# EasyEDA Pro project pcb工程文件.epro, board bat-1
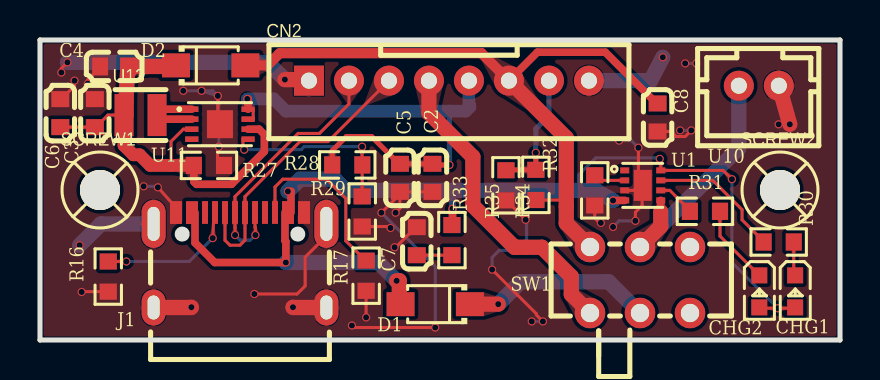
[diagram p4: board, top side]
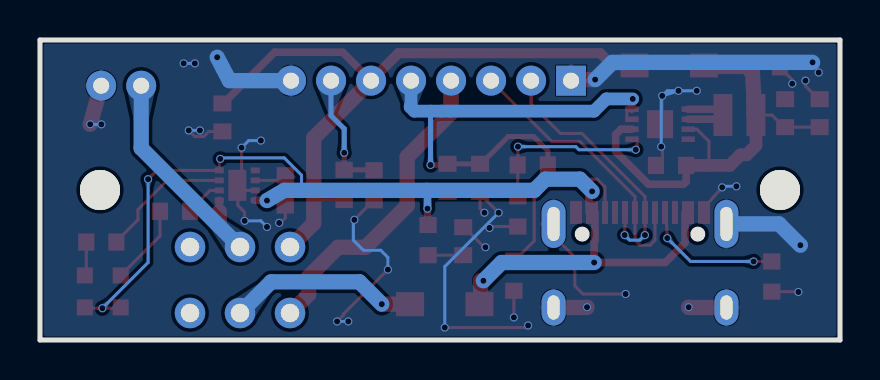
[diagram p5: board, bottom side, seen from below]

Outline 40 x 15 mm; copper layers: Top Layer, Bottom Layer. Coordinates in mm from the lower left corner of the outline.
Outline path: 0,15 40,15 40,0 0,0 0,15
Stack: Top Layer 0.035mm / SUBSTRATE1 1.51mm er 5 / Bottom Layer 0.035mm

## Design rules (mm)
spacing safeClearance (default): track to track 0.152, other pairs 0 to 0.152
track width trackWidth (default): min 0.152, default 0.152, max 0.152
differential pair differentialPair (default): width min 0.127, default 0.254, max 2.54; gap min 0.152, default 0.152
via viaSize (default): diameter min 0.5, default 0.61, max 10; hole min 0.3, default 0.305, max 6
net GND uses POR61265633
pour ie1328 uses POR94191934
pour ie1329 uses POR61265633

## Placement (name value [footprint] x y rotation side)
C2  100nF  [C0603]  19.62 8.11 90 top
C3  100nF  [C0603]  2.74 11.34 270 top
C4  22uF  [C0603]  3.71 13.68 0 top
C5  22uF  [C0603]  18 8.11 90 top
C6  1uF  [C0603]  1.02 11.34 90 top
C7  10uF  [C0603]  18.84 4.94 90 top
C8  100nF  [C0603]  30.88 11.13 90 top
CHG1  KT-0603R  [LED0603-RD]  37.76 2.43 270 top
CHG2  KT-0603R  [LED0603-RD]  35.97 2.43 270 top
CN2  WAFER-PH2.0-8PZZ  [CONN-TH_8P-P2.00_HDGC2001WV-8P]  20.45 12.97 0 top
D1  DSK34  [SOD-123FL_L2.7-W1.8-LS3.8-RD]  19.76 1.79 180 top
D2  DSK34  [SOD-123FL_L2.7-W1.8-LS3.8-RD]  8.53 13.73 0 top
J1  24018-UCAF001-A  [TYPE-C-USB-SMD_CF003]  10 4 0 top
R16  5.1kΩ  [R0603]  3.41 3.17 90 top
R17  5.1kΩ  [R0603]  16.31 3.21 90 top
R27  1MΩ  [R0603]  8.45 8.73 180 top
R28  220kΩ  [R0603]  15.36 8.75 180 top
R29  68kΩ  [R0603]  16.11 6.43 90 top
R30  1kΩ  [R0603]  36.93 4.9 180 top
R31  1kΩ  [R0603]  33.25 6.44 180 top
R32  5.1kΩ  [R0603]  27.74 7.48 270 top
R33  0Ω  [R0603]  20.6 4.99 270 top
R34  300kΩ  [R0603]  24.79 7.75 270 top
R35  100kΩ  [R0603]  23.3 7.73 270 top
SCREW1  -  [M2__]  3 7.5 0 top
SCREW2  -  [M2__]  37 7.5 0 top
SW1  MSK-22D18G3 051  [SW-TH_HX-MSK-22D18G3-051]  30 3 0 top
U1  LGS4056HDA  [DFN-8_L2.0-W2.0-P0.50-TL-EP1.6]  30.14 7.73 0 top
U10  WAFER-PH2.0-2PZZ  [CONN-TH_2P-P2.00_HC-PH-2A-M]  35.94 12.71 180 top
U11  SY7088DGC  [DFN-8_L3.0-W2.0-P0.50-BL-EP]  9 10.79 270 top
U13  1.5uH  [IND-SMD_L2.5-W2.0_FTC252010S]  5.03 11.25 0 top

## Footprints (pads in the part's own frame, mm; a bottom-side part is the same pattern mirrored in y, then rotated)
C0603
  rect 0.8x0.9 smd: 1(-0.7,0) 2(0.7,0)
CONN-TH_2P-P2.00_HC-PH-2A-M
  round 1.5 hole 0.8: 1(-1,0) 2(1,0)
CONN-TH_8P-P2.00_HDGC2001WV-8P
  rect 1.5x1.5 hole 0.8: 1(-7,0)
  round 1.5 hole 0.8: 2(-5,0) 3(-3,0) 4(-1,0) 5(1,0) 6(3,0) 7(5,0) 8(7,0)
DFN-8_L2.0-W2.0-P0.50-TL-EP1.6
  rect 0.45x0.3 smd: 1(-0.9,0.75) 2(-0.9,0.25) 3(-0.9,-0.25) 4(-0.9,-0.75) 5(0.9,-0.75) 6(0.9,-0.25) 7(0.9,0.25) 8(0.9,0.75)
  rect 0.9x1.55 smd: 9(-0.001,0.002)
DFN-8_L3.0-W2.0-P0.50-BL-EP
  rect 0.28x0.665 smd: 1(-0.75,-1.407) 2(-0.25,-1.407) 3(0.25,-1.407) 4(0.75,-1.407) 5(0.75,1.407) 6(0.25,1.407) 7(-0.25,1.407) 8(-0.75,1.407)
  rect 1.4x1.3 smd: 9(0,0)
IND-SMD_L2.5-W2.0_FTC252010S
  rect 0.95x2.1 smd: 1(-0.825,0) 2(0.825,0)
LED0603-RD
  rect 0.8x0.8 smd: 1(-0.799,0) 2(0.799,0)
M2__
  round 2 hole 2: 1(0,0)
R0603
  rect 0.806x0.864 smd: 1(-0.753,0) 2(0.753,0)
SOD-123FL_L2.7-W1.8-LS3.8-RD
  rect 1.4x1.2 smd: 1(-1.735,0) 2(1.735,0)
SW-TH_HX-MSK-22D18G3-051
  round 1.524 hole 0.914: 1(-2.5,1.65) 2(0,1.65) 3(2.5,1.65) 4(-2.5,-1.65) 5(0,-1.65) 6(2.5,-1.65)
TYPE-C-USB-SMD_CF003
  oval 1.2x2.4 hole 0.6x1.7: 17(4.32,1.805) 20(-4.32,1.805)
  oval 1.2x1.8 hole 0.6x1.2: 18(4.32,-2.375) 19(-4.32,-2.375)
  rect 0.3x1.14 smd: A1(-3.35,2.373) A4(-2.55,2.371) A5(-1.25,2.375) A6(-0.25,2.375) A7(0.25,2.373) A8(1.25,2.375) A9(2.55,2.375) A12(3.35,2.375) B1(3.05,2.375) B4(2.25,2.375) B5(1.75,2.375) B6(0.75,2.375) B7(-0.75,2.373) B8(-1.75,2.375) B9(-2.25,2.371) B12(-3.05,2.373)

## Nets
5VIN: CN2.4 SW1.4
GND: C2.1 C3.1 C4.1 C5.1 C6.2 C7.2 C8.1 CN2.1 CN2.8 J1.17 J1.18 J1.19 J1.20 J1.A1 J1.A12 J1.B1 J1.B12 R16.1 R17.1 R27.1 R29.1 R32.2 R35.2 U1.3 U1.9 U10.1 U11.9
VBAT: C8.2 CN2.6 D2.2 R34.2 SW1.1
VCC_SERVO: C2.2 C5.2 CN2.5 R28.2 U11.7 U11.8
$$$1: R28.1 R29.2 U11.5
$$$2: U11.1 U11.2 U13.2
$$$3: C3.2 C4.2 C6.1 D2.1 R27.2 U11.3 U11.6 U13.1
$$$4: R30.2 U1.7
$$$5: R32.1 U1.2
$$$6: R31.2 U1.6
$$$7: J1.B5 R17.2
$$$8: J1.A5 R16.2
$$$9: CHG1.1 R30.1
$$$10: CHG2.1 R31.1
$$$11: C7.1 R33.2
BAT+: SW1.2 U1.5 U10.2
D+: CN2.2 J1.A6 J1.B6
D-: CN2.3 J1.A7 J1.B7
IO10: CN2.7 R34.1 R35.1
U5VIN: D1.1 SW1.5
USB5V: CHG1.2 CHG2.2 D1.2 J1.A4 J1.A9 J1.B4 J1.B9 R33.1 U1.4 U1.8

Pads without a net: J1 A8 B8; SCREW1 1; SCREW2 1; SW1 3 6; U1 1; U11 4

## Via types
v1: diameter 0.406, hole 0.305, Top Layer to Bottom Layer, 57 vias

## Routing (per net, layer and track width the routed paths; a pad name or vN(x,y) marks a point on that pad's centre or on a via; arc(x,y) is an arc through that point)
5VIN: length 15.8
  Top Layer w0.762: CN2.4 19.45,11.35 21.64,9.16 21.64,6.72 23.72,4.64 25.09,4.64 26.57,3.17 26.57,2.28 SW1.4
GND: length 88
  Top Layer w0.152: v1(1.07,13.37) 1.07,13.58 v1(1.37,13.88) ; U1.3 29.69,7.48 29.92,7.71 v1(29.92,9.61) ; v1(5.89,7.63) 6.58,6.87 6.65,6.78 J1.A1 ; v1(15.6,0.72) 15.7,0.62 v1(19.76,0.62) ; v1(1.73,12.97) 1.73,12.7 1.07,12.04 C6.2 ; C5.1 18,6.58 v1(17.78,6.36) ; 23.89,2.24 24.82,1.3 24.82,1.25 v1(25.15,0.93) ; U1.9 30.11,7.73 30.11,6.73 29.77,6.39 v1(29.77,5.96) ; v1(8.94,9.67) 8.87,9.67 8.87,8.73 R27.1 ; R29.1 17.45,5.67 v1(17.53,5.6) ; C2.1 18.11,7.41 v1(17.07,6.36) ; v1(22.61,3.52) 23.89,2.24 ; v1(17.73,4.64) 17.79,4.64 18.79,5.64 C7.2 ; C4.1 3.01,13.63 2.39,13.01 v1(2.39,12.82) ; R16.1 2.1,2.42 v1(2.08,2.4) ; v1(10.72,2.3) 12.85,2.3 13.26,2.71 13.26,4.14 14.32,5.2 J1.17 ; R35.2 23.34,6.98 v1(24.28,6.01) ; U11.9 8.89,10.79 v1(8.89,12.21) ; v1(32.56,10.48) 32.26,10.17 31.81,10.17 31.56,10.43 C8.1 ; R32.2 27.74,6.1 27.98,5.86 v1(28.04,5.86) ; R17.1 v1(16.31,1.13)
  Top Layer w0.762: U10.1 v1(37.49,10.78) ; J1.19 7.55,1.62 v1(7.57,1.64) ; J1.18 12.66,1.62 v1(12.65,1.64) ; CN2.1 13.45,13.02 v1(12.24,13.02)
  Bottom Layer w0.152: v1(24.28,6.01) 24.33,5.96 24.33,4.99 23.82,4.48 22.96,4.48 22.61,4.13 v1(22.61,3.52) ; v1(17.07,6.36) 19.76,3.67 v1(19.76,0.62) ; v1(28.65,5.65) 28.96,5.96 v1(29.77,5.96) ; v1(32.82,13.83) v1(32.26,13.83) ; v1(25.15,0.93) v1(24.59,0.93) ; v1(5.18,7.69) 5.84,7.69 v1(5.89,7.63) ; v1(29.92,9.61) 29.57,9.97 v1(28.96,9.97) ; v1(8.94,9.67) 8.94,12.16 8.64,12.46 v1(7.16,12.46) ; v1(8.89,12.21) v1(8.08,12.46) ; v1(32.56,10.48) v1(32,10.48) ; v1(37.49,10.78) v1(36.93,10.78)
  Bottom Layer w0.762: v1(1.37,13.88) 11.38,13.88 v1(12.24,13.02) ; J1.20 3.05,5.81 v1(1.98,4.74) ; v1(31.14,14.14) 30.53,12.97 CN2.8
VBAT: length 34.7
  Top Layer w0.152: R34.2 25.98,7 26.31,6.67
  Top Layer w0.381: C8.2 30.83,11.83 28.26,14.39 24.87,14.39 CN2.6
  Top Layer w0.508: D2.2 11.38,13.73 11.99,14.34 22.08,14.34 CN2.6
  Top Layer w0.762: CN2.6 26.31,10.1 26.31,5.84 SW1.1
VCC_SERVO: length 24.5
  Top Layer w0.152: U11.8 10.66,11.54 10.66,11.04 U11.7
  Top Layer w0.254: R28.2 14.61,9.46 15.32,10.17 16.58,10.17 17.95,8.81 C5.2 C2.2 19.62,8.75 v1(20.47,8.75)
  Top Layer w0.381: v1(10.36,12.05) 10.4,12.05 U11.8
  Bottom Layer w0.254: 20.47,11.44 v1(20.47,8.75)
  Bottom Layer w0.635: CN2.5 21.45,11.74 21.49,11.7 21.49,11.65 21.28,11.44 12.29,11.44 11.68,12.05 v1(10.36,12.05)
$$$1: length 9.3
  Top Layer w0.152: R29.2 16.11,8.75 16.12,8.75 16.1,8.75 v1(16.1,9.67) ; U11.5 10.15,10.04 10.15,9.51 v1(10.21,9.51)
  Bottom Layer w0.152: v1(16.1,9.67) 13.21,9.67 13.06,9.51 v1(10.21,9.51)
$$$2: length 4
  Top Layer w0.381: U11.1 5.85,11.54 U13.2 5.85,11.04 U11.2
$$$3: length 23.3
  Top Layer w0.152: 6.55,8.73 6.55,9.93 7.16,10.54 U11.3 ; R27.2 7.69,8.7 ; U13.1 3.4,11.25 2.79,10.64 C3.2 C6.1
  Top Layer w0.381: R27.2 7.69,7.92 7.82,7.79 9.58,7.79 11.22,9.42 11.22,10.28 10.95,10.54 U11.6
  Top Layer w0.635: 7.62,8.73 R27.2 5.51,8.73 4.98,9.26 4.67,9.26 4.2,9.73 U13.1
  Top Layer w0.762: D2.1 6.8,13.68 C4.2 4.39,13.68 4.39,13.61 4.3,11.92 4.3,11.25 U13.1
$$$4: length 6.7
  Top Layer w0.152: R30.2 36.18,4.93 35.1,6.01 35.1,6.52 33.64,7.98 U1.7
$$$5: length 1.8
  Top Layer w0.152: U1.2 27.74,7.98 R32.1
$$$6: length 1.9
  Top Layer w0.152: R31.2 32.5,6.44 32.5,6.47 31.49,7.48 U1.6
$$$7: length 8.9
  Top Layer w0.152: J1.B5 11.75,7.65 12.14,8.04 14.33,8.04 15.29,7.08 15.29,4.95 16.28,3.97 R17.2
$$$8: length 7.1
  Top Layer w0.152: v1(4.32,3.93) 3.41,3.93 ; J1.A5 8.68,6.38 8.68,5.88 v1(8.64,5.09)
  Bottom Layer w0.152: v1(8.64,5.09) 7.47,3.93 v1(4.32,3.93)
$$$9: length 1.7
  Top Layer w0.152: CHG1.1 37.69,3.23 R30.1
$$$10: length 4
  Top Layer w0.152: R31.1 34,5.19 CHG2.1
$$$11: length 1.8
  Top Layer w0.152: C7.1 R33.2
BAT+: length 12.9
  Top Layer w0.381: U1.5 31.04,6.42
  Top Layer w0.762: 31.04,6.42 31.04,5.69 SW1.2
  Bottom Layer w0.762: U10.2 34.94,9.59 SW1.2
D+: length 13.6
  Top Layer w0.152: v1(10.77,5.25) 10.77,5.62 10.75,5.64 J1.B6 10.75,6.51 10.82,6.87 ; v1(9.75,5.25) 9.75,5.63 9.75,5.63 J1.A6 9.75,7.17 12.9,10.33 13.97,10.33 15.45,11.8 CN2.2
  Bottom Layer w0.152: v1(10.77,5.25) 10.52,4.99 10.01,4.99 v1(9.75,5.25)
D-: length 14.4
  Top Layer w0.152: 10.25,5.58 10.25,4.99 10,4.74 9.5,4.74 9.25,4.99 J1.B7 ; 10.25,5.58 J1.A7 10.25,7.17 13,9.92 14.4,9.92 CN2.3
IO10: length 6.3
  Top Layer w0.254: R35.1 23.3,8.51 R34.1 24.79,8.51 v1(24.79,9.36)
  Bottom Layer w0.254: CN2.7 25.45,11.22 24.79,10.56 v1(24.79,9.36)
U5VIN: length 9.6
  Top Layer w0.762: D1.1 v1(22.91,1.79)
  Bottom Layer w0.762: v1(22.91,1.79) 24.03,2.91 28.44,2.91 SW1.5
USB5V: length 58.2
  Top Layer w0.152: J1.B4 12.25,5.88 12.55,5.88 J1.A9 ; 35.97,1.63 35.97,1.59 v1(36.88,1.59) 37.76,1.59 CHG1.2 ; v1(30.99,9.06) 31.04,9.01 U1.8 34.15,8.48 v1(34.59,8.04) ; J1.A4 7.45,5.88 7.75,5.88 J1.B9
  Top Layer w0.381: v1(20.62,6.57) 20.62,5.75 R33.1 ; J1.B4 12.25,4.96 12.29,4.92 v1(12.29,3.88) 8.74,3.88 7.75,4.86 J1.B9 ; J1.A9 12.55,7.43 v1(12.4,7.43) ; U1.4 28.65,6.98 v1(28.65,6.97)
  Top Layer w0.762: v1(17.83,2.96) 17.97,2.96 17.97,1.79 D1.2
  Bottom Layer w0.152: v1(36.88,1.59) 34.59,3.88 v1(34.59,8.04) ; v1(30.99,9.06) 31.01,9.08 30.99,9.11 27.79,9.11 26.92,8.24 26.92,7.48
  Bottom Layer w0.381: 20.68,7.48 20.62,7.43 v1(20.62,6.57)
  Bottom Layer w0.762: v1(12.4,7.43) 13,8.04 14.73,8.04 15.29,7.48 27.79,7.48 v1(28.65,6.97) ; v1(12.29,3.88) 16.92,3.88 v1(17.83,2.96)

## Copper pours and planes (outline as drawn; the poured copper is in the pictures)
GND on Top Layer: -0.97,16.07 41.1,16.07 41.1,-1.71 -0.97,-1.71
GND on Bottom Layer: -0.51,18.05 40.18,18.05 40.18,-4.76 -0.51,-4.76

Small or netless copper shapes (teardrops, artwork), in the pictures only: 77 on Top Layer, 36 on Bottom Layer
